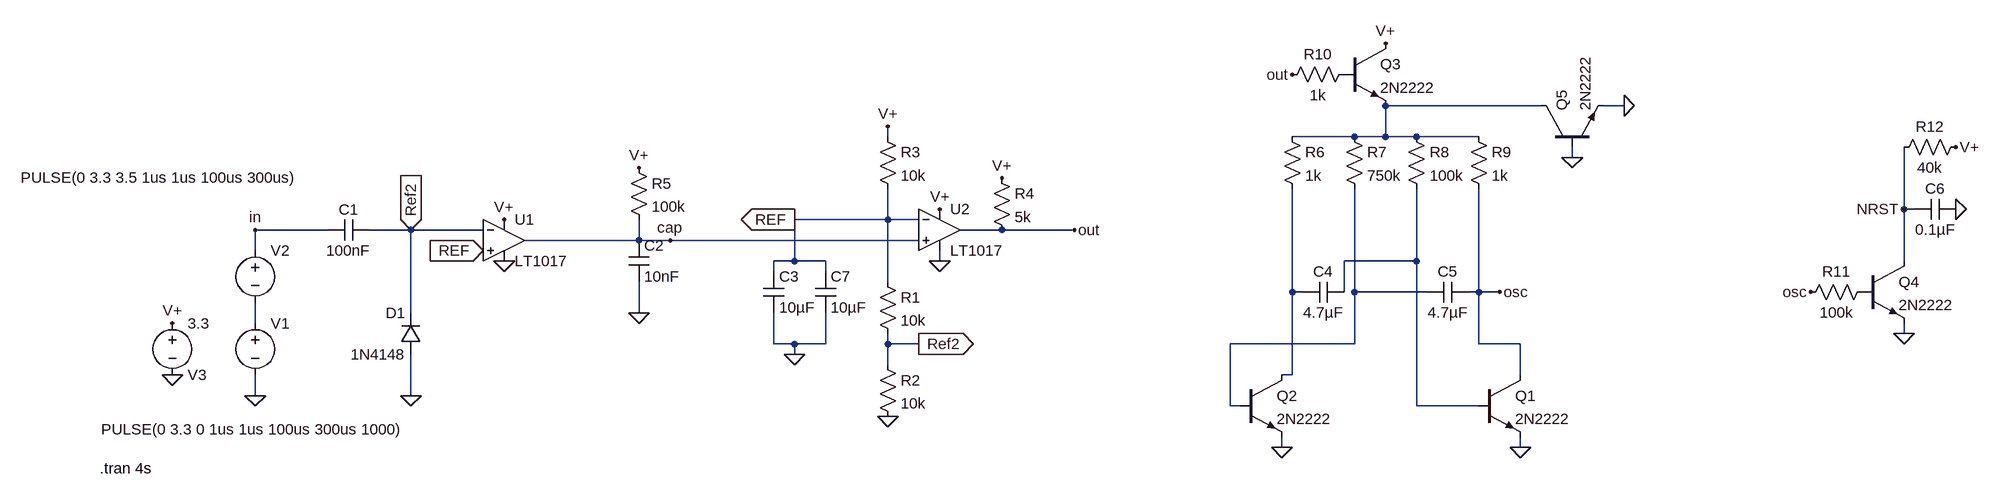
[diagram p0: schematic Analog Watchdog.asc]
Analog Watchdog.asc, the LTspice schematic file:
Version 4.1
SHEET 1 2788 680
WIRE 2096 -112 1856 -112
WIRE 2224 -112 2192 -112
WIRE 1088 -64 1088 -80
WIRE 1808 -64 1712 -64
WIRE 1856 -64 1856 -112
WIRE 1856 -64 1808 -64
WIRE 1904 -64 1856 -64
WIRE 2000 -64 1904 -64
WIRE 2144 -32 2144 -48
WIRE 2656 48 2656 -48
WIRE 2672 48 2656 48
WIRE 1088 64 1088 16
WIRE 1088 64 944 64
WIRE 1136 64 1088 64
WIRE 224 80 112 80
WIRE 352 80 288 80
WIRE 464 80 352 80
WIRE 1264 80 1200 80
WIRE 1376 80 1264 80
WIRE 704 96 704 64
WIRE 704 96 528 96
WIRE 752 96 704 96
WIRE 1136 96 752 96
WIRE 112 112 112 80
WIRE 944 128 944 64
WIRE 944 128 912 128
WIRE 992 128 944 128
WIRE 1168 128 1168 112
WIRE 1904 128 1904 16
WIRE 1904 128 1792 128
WIRE 2656 128 2656 48
WIRE 912 144 912 128
WIRE 992 144 992 128
WIRE 1088 160 1088 64
WIRE 1712 176 1712 16
WIRE 1728 176 1712 176
WIRE 1792 176 1792 128
WIRE 1808 176 1808 16
WIRE 1920 176 1808 176
WIRE 2000 176 2000 16
WIRE 2000 176 1984 176
WIRE 2032 176 2000 176
WIRE 352 208 352 80
WIRE 704 208 704 160
WIRE 112 224 112 192
WIRE 2656 240 2656 224
WIRE 912 256 912 208
WIRE 944 256 912 256
WIRE 992 256 992 208
WIRE 992 256 944 256
WIRE 1088 256 1088 240
WIRE 1136 256 1088 256
WIRE 1808 256 1808 176
WIRE 1808 256 1616 256
WIRE 2000 256 2000 176
WIRE 2064 256 2000 256
WIRE 944 272 944 256
WIRE 1088 288 1088 256
WIRE 1712 304 1712 176
WIRE 1712 304 1696 304
WIRE 2064 304 2064 256
WIRE 112 336 112 304
WIRE 352 336 352 272
WIRE 1616 352 1616 256
WIRE 1632 352 1616 352
WIRE 1904 352 1904 128
WIRE 2000 352 1904 352
WIRE 1696 416 1696 400
WIRE 2064 416 2064 400
FLAG 112 336 0
FLAG 352 336 0
FLAG 704 208 0
FLAG 944 272 0
FLAG 1088 368 0
FLAG -16 304 0
FLAG 1136 256 Ref2
IOPIN 1136 256 Out
FLAG 352 80 Ref2
IOPIN 352 80 In
FLAG 464 112 REF
IOPIN 464 112 In
FLAG 944 64 REF
IOPIN 944 64 Out
FLAG 112 80 in
FLAG 752 96 cap
FLAG 496 128 0
FLAG 1168 128 0
FLAG -16 224 V+
FLAG 704 -16 V+
FLAG 1696 416 0
FLAG 2064 416 0
FLAG 2032 176 osc
FLAG 1856 -208 V+
FLAG 1376 80 out
FLAG 1712 -160 out
FLAG 496 64 V+
FLAG 1168 48 V+
FLAG 1088 -80 V+
FLAG 1264 0 V+
FLAG 2656 240 0
FLAG 2736 -48 V+
FLAG 2736 48 0
FLAG 2656 48 NRST
FLAG 2512 176 osc
FLAG 2224 -112 0
FLAG 2144 -32 0
SYMBOL voltage 112 208 R0
WINDOW 3 -238 180 Left 2
WINDOW 123 0 0 Left 0
WINDOW 39 0 0 Left 0
SYMATTR Value PULSE(0 3.3 0 1us 1us 100us 300us 1000)
SYMATTR InstName V1
SYMBOL cap 288 64 R90
WINDOW 0 0 32 VBottom 2
WINDOW 3 32 32 VTop 2
SYMATTR InstName C1
SYMATTR Value 100nF
SYMBOL diode 368 272 R180
WINDOW 0 24 64 Left 2
WINDOW 3 24 0 Left 2
SYMATTR InstName D1
SYMATTR Value 1N4148
SYMBOL voltage -16 208 R0
WINDOW 0 24 96 Left 2
WINDOW 3 24 16 Left 2
WINDOW 123 0 0 Left 0
WINDOW 39 0 0 Left 0
SYMATTR InstName V3
SYMATTR Value 3.3
SYMBOL cap 688 96 R0
SYMATTR InstName C2
SYMATTR Value 10nF
SYMBOL res 1072 144 R0
SYMATTR InstName R1
SYMATTR Value 10k
SYMBOL res 1072 272 R0
SYMATTR InstName R2
SYMATTR Value 10k
SYMBOL res 1072 -80 R0
SYMATTR InstName R3
SYMATTR Value 10k
SYMBOL res 1248 -16 R0
SYMATTR InstName R4
SYMATTR Value 5k
SYMBOL res 688 -32 R0
SYMATTR InstName R5
SYMATTR Value 100k
SYMBOL Comparators\\LT1017 496 96 R0
SYMATTR InstName U1
SYMBOL Comparators\\LT1017 1168 80 R0
SYMATTR InstName U2
SYMBOL res 1696 -80 R0
SYMATTR InstName R6
SYMATTR Value 1k
SYMBOL res 1792 -80 R0
SYMATTR InstName R7
SYMATTR Value 750k
SYMBOL res 1888 -80 R0
SYMATTR InstName R8
SYMATTR Value 100k
SYMBOL res 1984 -80 R0
SYMATTR InstName R9
SYMATTR Value 1k
SYMBOL cap 1792 160 R90
WINDOW 0 0 32 VBottom 2
WINDOW 3 32 32 VTop 2
SYMATTR InstName C4
SYMATTR Value 4.7µF
SYMBOL cap 1984 160 R90
WINDOW 0 0 32 VBottom 2
WINDOW 3 32 32 VTop 2
SYMATTR InstName C5
SYMATTR Value 4.7µF
SYMBOL npn 2000 304 R0
SYMATTR InstName Q1
SYMATTR Value 2N2222
SYMBOL npn 1632 304 R0
SYMATTR InstName Q2
SYMATTR Value 2N2222
SYMBOL npn 1792 -208 R0
SYMATTR InstName Q3
SYMATTR Value 2N2222
SYMBOL res 1696 -144 R270
WINDOW 0 32 56 VTop 2
WINDOW 3 0 56 VBottom 2
SYMATTR InstName R10
SYMATTR Value 1k
SYMBOL npn 2592 128 R0
SYMATTR InstName Q4
SYMATTR Value 2N2222
SYMBOL res 2496 192 R270
WINDOW 0 32 56 VTop 2
WINDOW 3 0 56 VBottom 2
SYMATTR InstName R11
SYMATTR Value 100k
SYMBOL res 2752 -64 R90
WINDOW 0 0 56 VBottom 2
WINDOW 3 32 56 VTop 2
SYMATTR InstName R12
SYMATTR Value 40k
SYMBOL cap 2736 32 R90
WINDOW 0 0 32 VBottom 2
WINDOW 3 32 32 VTop 2
SYMATTR InstName C6
SYMATTR Value 0.1µF
SYMBOL voltage 112 96 R0
WINDOW 3 -362 -97 Left 2
WINDOW 123 0 0 Left 0
WINDOW 39 0 0 Left 0
SYMATTR Value PULSE(0 3.3 3.5 1us 1us 100us 300us)
SYMATTR InstName V2
SYMBOL npn 2096 -48 R270
SYMATTR InstName Q5
SYMATTR Value 2N2222
SYMBOL cap 896 144 R0
SYMATTR InstName C3
SYMATTR Value 10µF
SYMBOL cap 976 144 R0
SYMATTR InstName C7
SYMATTR Value 10µF
TEXT -128 448 Left 2 !.tran 4s

The netlist it stands for:
* Analog Watchdog.asc
V1 N005 0 PULSE(0 3.3 0 1us 1us 100us 300us 1000)
C1 Ref2 in 100nF
D1 0 Ref2 1N4148
V3 V+ 0 3.3
C2 cap 0 10nF
R1 REF Ref2 10k
R2 Ref2 0 10k
R3 V+ REF 10k
R4 V+ out 5k
R5 V+ cap 100k
X§U1 REF Ref2 V+ 0 cap LT1017  ; pins In+ In- V+ V- OUT
X§U2 cap REF V+ 0 out LT1017  ; pins In+ In- V+ V- OUT
R6 N001 N003 1k
R7 N001 N004 750k
R8 N001 N002 100k
R9 N001 osc 1k
C4 N002 N003 4.7µF
C5 osc N004 4.7µF
Q1 osc N002 0 0 2N2222
Q2 N003 N004 0 0 2N2222
Q3 V+ P001 N001 0 2N2222
R10 out P001 1k
Q4 NRST P002 0 0 2N2222
R11 osc P002 100k
R12 V+ NRST 40k
C6 0 NRST 0.1µF
V2 in N005 PULSE(0 3.3 3.5 1us 1us 100us 300us)
Q5 N001 0 0 0 2N2222
C3 REF 0 10µF
C7 REF 0 10µF
.model D D
.lib standard.dio
.model NPN NPN
.model PNP PNP
.lib standard.bjt
.tran 4s
.backanno
.end